# Altium schematic sheet SW3203.SchDoc
size A3; SheetNumber: 1; SheetTotal: 1
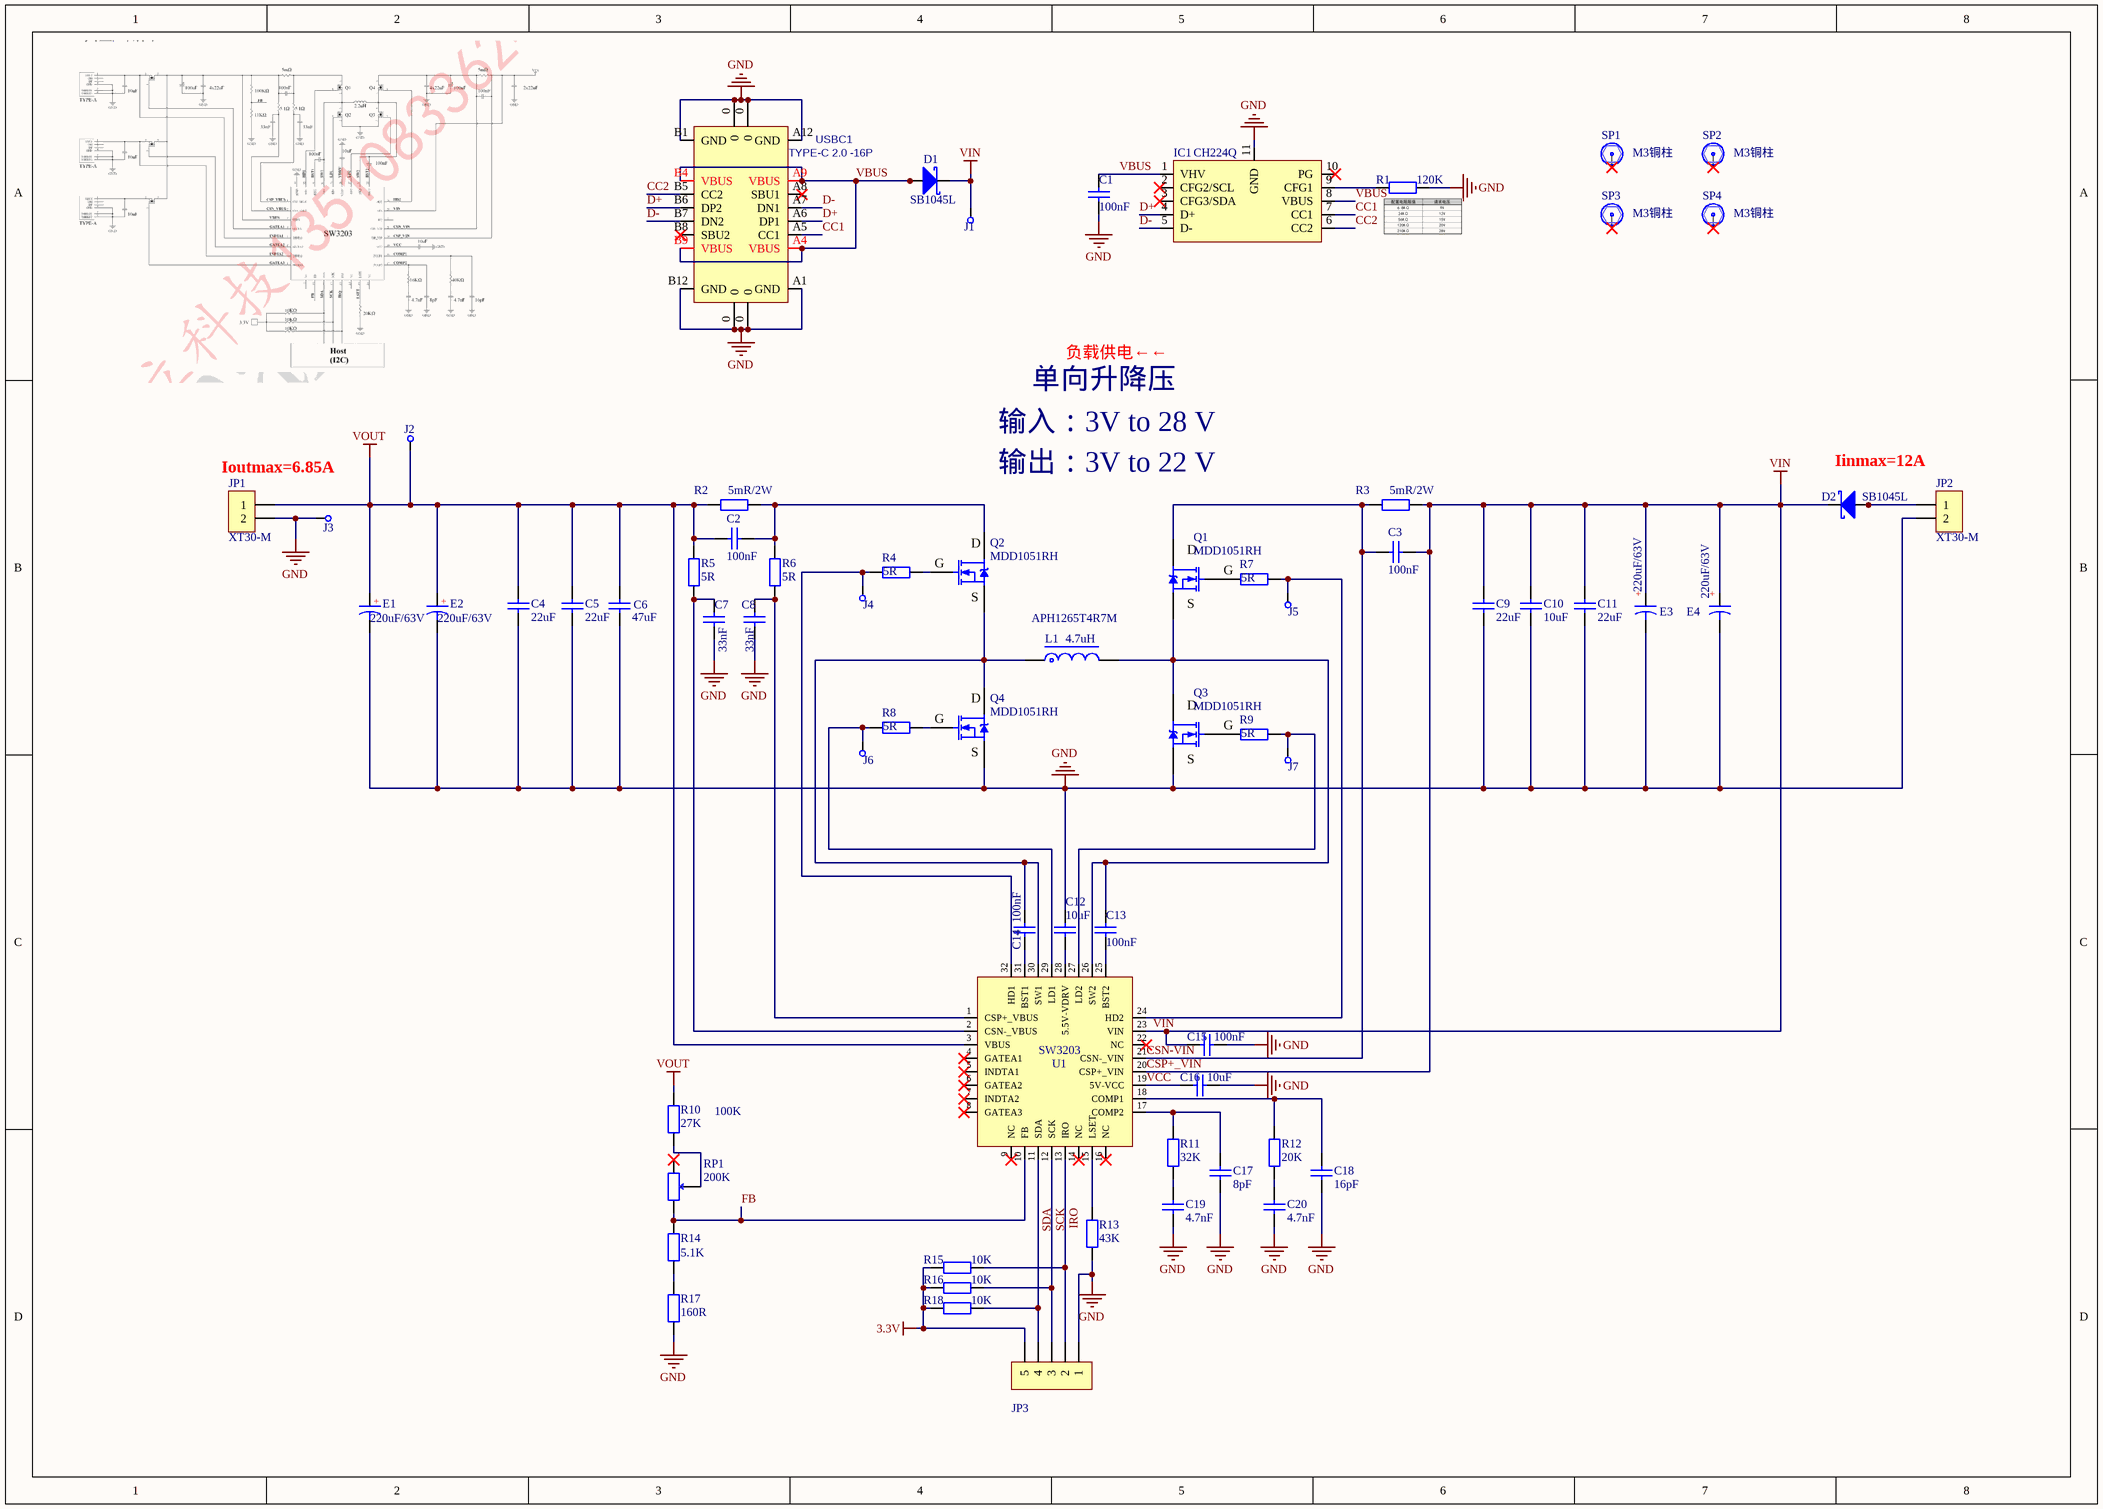
[diagram p0: SW3203.SchDoc]

## Parts
C1  100nF  [C0805_L]
C2  100nF  [C0805_L]
C3  100nF  [C0805_L]
C4  22uF  [C0805_L]
C5  22uF  [C0805_L]
C6  47uF  [C0805_L]
C7  33nF  [C0805_L]
C8  33nF  [C0805_L]
C9  22uF  [C0805_L]
C10  10uF  [C0805_L]
C11  22uF  [C0805_L]
C12  10uF  [C0805_L]
C13  100nF  [C0805_L]
C14  100nF  [C0805_L]
C15  100nF  [C0805_L]
C16  10uF  [C0805_L]
C17  8pF  [C0805_L]
C18  16pF  [C0805_L]
C19  4.7nF  [C0805_L]
C20  4.7nF  [C0805_L]
D1  SB1045L  [TO-277_3P-L5.4-W4.0]
D2  SB1045L  [TO-277_3P-L5.4-W4.0]
E1  220uF/63V  [CT 5.0*10*13 - R]
E2  220uF/63V  [CT 5.0*10*13 - R]
E3  220uF/63V  [CT 5.0*10*13 - R]
E4  220uF/63V  [CT 5.0*10*13 - R]
IC1  CH224Q  [DFN-10_L2.0-W2]
J1  CHECK  [CHECK-A]  (value not drawn)
J2  CHECK  [CHECK-A]  (value not drawn)
J3  CHECK  [CHECK-A]  (value not drawn)
J4  CHECK  [CHECK-A]  (value not drawn)
J5  CHECK  [CHECK-A]  (value not drawn)
J6  CHECK  [CHECK-A]  (value not drawn)
J7  CHECK  [CHECK-A]  (value not drawn)
JP1  XT30-M  [XT30PW-M]
JP2  XT30-M  [XT30PW-M]
JP3  HDR-1X5  [HDR2.54-M-LI-5P]  (value not drawn)
L1  4.7uH  [SMD,13.5x12.6mm]
Q1  MDD1051RH  [TO252]
Q2  MDD1051RH  [TO252]
Q3  MDD1051RH  [TO252]
Q4  MDD1051RH  [TO252]
R1  120K  [R0805_L]
R2  5mR/2W  [R2512_M]
R3  5mR/2W  [R2512_M]
R4  5R  [R0805_L]
R5  5R  [R0805_L]
R6  5R  [R0805_L]
R7  5R  [R0805_L]
R8  5R  [R0805_L]
R9  5R  [R0805_L]
R10  27K  [R0805_L]
R11  32K  [R0805_L]
R12  20K  [R0805_L]
R13  43K  [R0805_L]
R14  5.1K  [R0805_L]
R15  10K  [R0805_L]
R16  10K  [R0805_L]
R17  160R  [R0805_L]
R18  10K  [R0805_L]
RP1  200K  [3296W]
SP1  M3铜柱  [M3x4_L]
SP2  M3铜柱  [M3x4_L]
SP3  M3铜柱  [M3x4_L]
SP4  M3铜柱  [M3x4_L]
U1  SW3203  [QFN32_L4.0-W4.0-P0.4]
USBC1  TYPE-C 2.0 -16P  [USB-C-SMD_16P]

## Nets
3.3V: JP3.5 R15.1 R16.1 R18.1
CSP+_VIN: C3.1 C9.2 C10.2 C11.2 C15.2 D1.2(K) D2.2(K) E3.1 E4.1 J1.1 R3.1 U1.20(CSP+_VIN) U1.23(VIN)  [also labelled VIN]
GND: C1.1 C4.1 C5.1 C6.1 C7.2 C8.2 C9.1 C10.1 C11.1 C12.2 C15.1 C16.1 C17.1 C18.1 C19.1 C20.1 E1.2 E2.2 E3.2 E4.2 IC1.11(GND) J3.1 JP1.2 JP2.2 JP3.1 Q3.3(S) Q4.3(S) R1.2 R13.2 R17.2 USBC1.0 USBC1.A1(GND) USBC1.A12(GND) USBC1.B1(GND) USBC1.B12(GND)
VOUT: C2.2 C4.2 C5.2 C6.2 E1.1 E2.1 J2.1 JP1.1 R2.2 R5.1 R10.1 U1.3(VBUS)
CC1: IC1.7(CC1) USBC1.A5(CC1)
CC2: IC1.6(CC2) USBC1.B5(CC2)
CSN-VIN: C3.2 Q1.2(D) R3.2 U1.21(CSN-_VIN)
D+: IC1.4(D+) USBC1.A6(DP1) USBC1.B6(DP2)
D-: IC1.5(D-) USBC1.A7(DN1) USBC1.B7(DN2)
FB: R14.1 RP1.1 U1.10(FB)
IRO: JP3.2 R15.2 U1.13(IRO)
SCK: JP3.3 R16.2 U1.12(SCK)
SDA: JP3.4 R18.2 U1.11(SDA)
VBUS: C1.2 D1.1(A) D1.3(A) IC1.1(VHV) IC1.8(VBUS) USBC1.A4(VBUS) USBC1.A9(VBUS) USBC1.B4(VBUS) USBC1.B9(VBUS)
VCC: C16.2 U1.19(5V-VCC)
NetC2_1: C2.1 Q2.2(D) R2.1 R6.1
NetC7_1: C7.1 R5.2 U1.2(CSN-_VBUS)
NetC8_1: C8.1 R6.2 U1.1(CSP+_VBUS)
NetC12_1: C12.1 U1.28(5.5V-VDRV)
NetC13_1: C13.1 U1.25(BST2)
NetC13_2: C13.2 L1.2 Q1.3(S) Q3.2(D) U1.26(SW2)
NetC14_1: C14.1 U1.31(BST1)
NetC14_2: C14.2 L1.1 Q2.3(S) Q4.2(D) U1.30(SW1)
NetC17_2: C17.2 R11.1 U1.17(COMP2)
NetC18_2: C18.2 R12.1 U1.18(COMP1)
NetC19_2: C19.2 R11.2
NetC20_2: C20.2 R12.2
NetD2_1: D2.1(A) D2.3(A) JP2.1
NetIC1_9: IC1.9(CFG1) R1.1
NetJ4_1: J4.1 R4.2 U1.32(HD1)
NetJ5_1: J5.1 R7.1 U1.24(HD2)
NetJ6_1: J6.1 R8.2 U1.29(LD1)
NetJ7_1: J7.1 R9.1 U1.27(LD2)
NetQ1_1: Q1.1(G) R7.2
NetQ2_1: Q2.1(G) R4.1
NetQ3_1: Q3.1(G) R9.2
NetQ4_1: Q4.1(G) R8.1
NetR10_2: R10.2 RP1.2
NetR13_1: R13.1 U1.15(LSET)
NetR14_2: R14.2 R17.1

Not connected (* = marked no-connect by the designer): IC1 2(CFG2/SCL)* 3(CFG3/SDA)* 10(PG)*; RP1 3*; SP1 1*; SP2 1*; SP3 1*; SP4 1*; U1 4(GATEA1)* 5(INDTA1)* 6(GATEA2)* 7(INDTA2)* 8(GATEA3)* 9(NC)* 14(NC)* 16(NC)* 22(NC)*; USBC1 A8(SBU1)* B8(SBU2)*

## Notes on the sheet
- 负载供电←←
- 输入：3V to 28 V
- 单向升降压
- Ioutmax=6.85A
- 输出：3V to 22 V
- Iinmax=12A
- APH1265T4R7M
- 100K
- (in symbol CS) +

## Library data of the parts
C1-C20 = C: 贴片电容/MLCC电容; BOM名称: 无极性贴片电容; 联系下单店铺卖家 免费帮你查找封装: 联系下单店铺卖家 免费技术指导
E1-E4 = CS: 直插固态电容; 联系下单店铺卖家 免费帮你查找封装: 联系下单店铺卖家 免费技术指导; 当前库版本V2025.1.5，下一版本发布时间2025年2月份 @淘宝卖家:黄晶宝石: 最新版本发布网址https://item.taobao.com/item.htm?id=566775463719; BOM名称: 直插固态电容
J1-J7 = CHECK: 测试点
JP1 JP2 = XT30-M: XT30公头; 当前库版本V2025.1.5，下一版本发布时间2025年2月份 @淘宝卖家:黄晶宝石: 最新版本发布网址https://item.taobao.com/item.htm?id=566775463719
JP3 = Header 5: 5P接插件; 联系卖家，免费查找封装: 唯一出售店铺网址https://shop463601444.taobao.com; 封装库来自淘宝卖家ID：黄晶宝石: 其他店铺购入均为盗版封装库，请立即申请退款，本店现金奖励50~200元; BOM名称: 5P接插件
L1 = L-Molding Choke: 一体成型电感; 联系下单店铺卖家 免费帮你查找封装: 联系下单店铺卖家 免费技术指导; BOM名称: 一体成型电感
Q1-Q4 = NCE3080: N沟道 30V/80A; BOM名称: N沟场效应管; 联系下单店铺卖家 免费帮你查找封装: 联系下单店铺卖家 免费技术支持; 当前库版本V2025.1.5，下一版本发布时间2025年2月份 @淘宝卖家:黄晶宝石: 最新版本发布网址https://item.taobao.com/item.htm?id=566775463719
R1-R18 = R: 贴片电阻; 联系下单店铺卖家 免费帮你查找封装: 联系下单店铺卖家 免费技术指导; BOM名称: 贴片电阻
RP1 = RP: 单联电位器; BOM名称: 插件电位器; 联系下单店铺卖家 免费帮你查找封装: 联系下单店铺卖家 免费技术指导
SP1-SP4 = 铜柱小焊盘: 铜柱; 联系下单店铺卖家 免费技术支持: 联系下单店铺卖家 免费帮你查找封装; BOM名称: 铜柱
U1 = SW3203: 3~28V同步 4 管升降压控制器
USBC1 = USB2.0_Type-C_16Pin: USB2.0_Type-C_16Pin母座; 当前库版本V2025.1.5，下一版本发布时间2025年2月份 @淘宝卖家:黄晶宝石: 最新版本发布网址https://item.taobao.com/item.htm?id=566775463719